# Altium schematic sheet HX711_load_cell_amplifier.SchDoc: HX711 load cell amplifier
size A4; SheetNumber: 19; SheetTotal: 20; TitleBig: HX711 load cell amplifier; Desc_line1: This circuit is used to get weight measurements out from load cells in order to estimate the density of a trunk or board.; Desc_line2: This design is based on the Sparkfun HX711 module by N. Seidle and A. Wende.
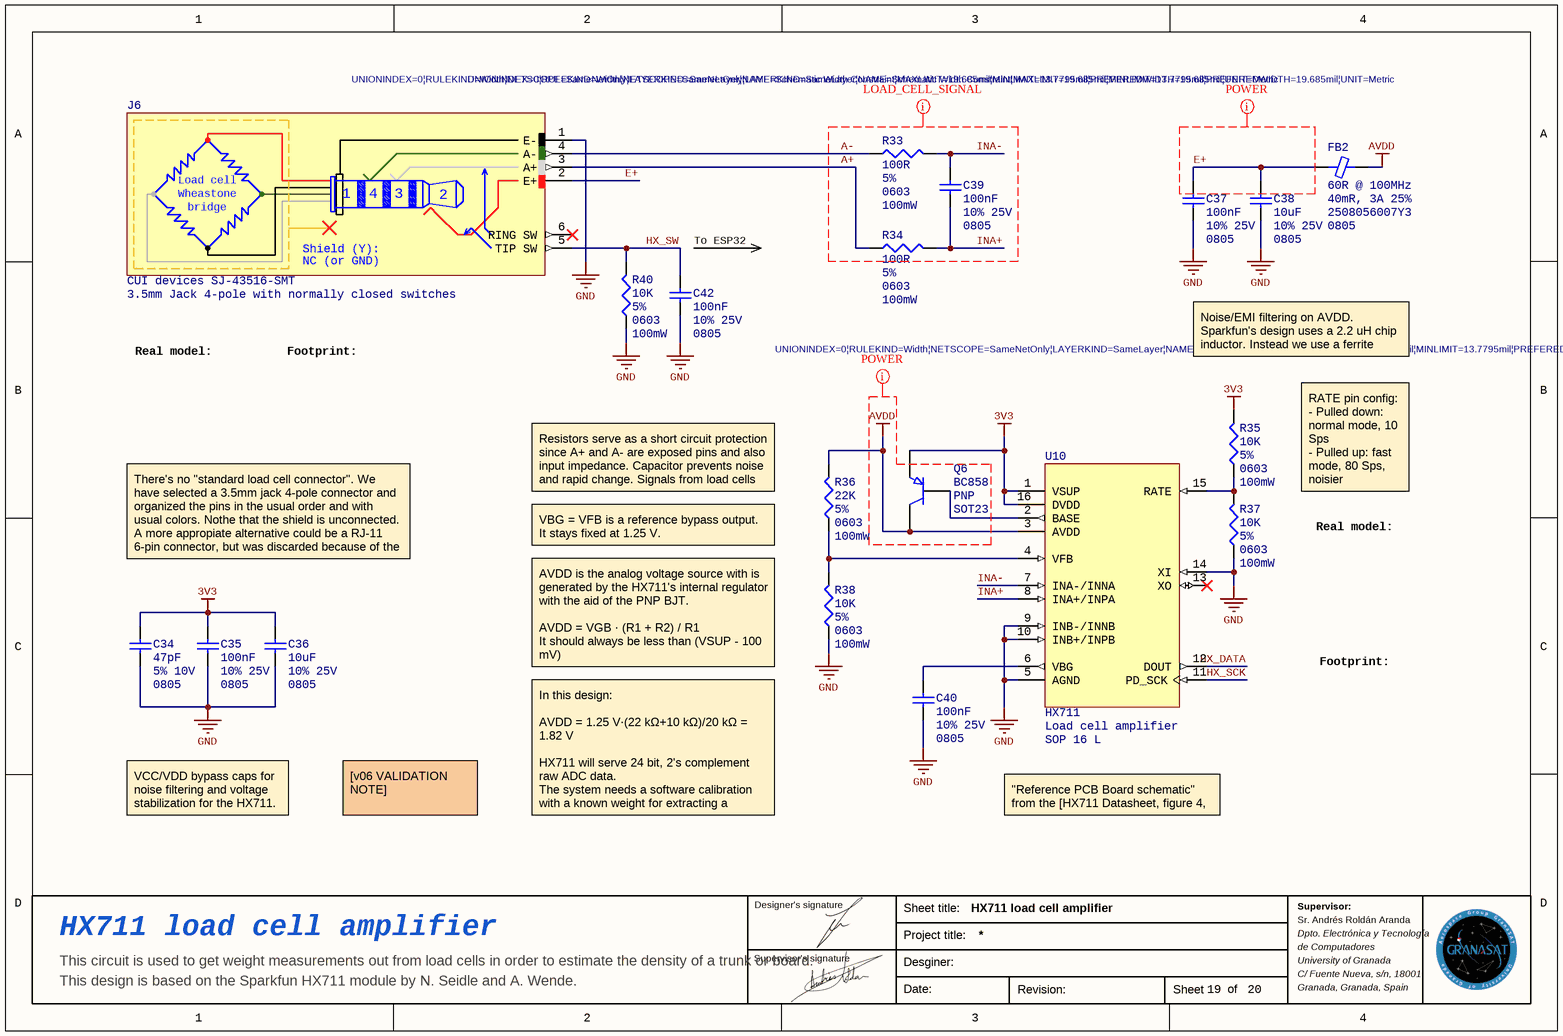
[diagram p0: HX711_load_cell_amplifier.SchDoc]

## Parts
C34  value 47pF  Tolerance: 5% 10V  PackageDescription: 0805  [CAP 0805_2012]  (hidden comment: Cap_cer_0805)
C35  value 100nF  Tolerance: 10% 25V  PackageDescription: 0805  [CAP 0805_2012]  (hidden comment: Cap_cer_0805)
C36  value 10uF  Tolerance: 10% 25V  PackageDescription: 0805  [CAP 0805_2012]  (hidden comment: Cap_cer_0805)
C37  value 100nF  Tolerance: 10% 25V  PackageDescription: 0805  [CAP 0805_2012]  (hidden comment: Cap_cer_0805)
C38  value 10uF  Tolerance: 10% 25V  PackageDescription: 0805  [CAP 0805_2012]  (hidden comment: Cap_cer_0805)
C39  value 100nF  Tolerance: 10% 25V  PackageDescription: 0805  [CAP 0805_2012]  (hidden comment: Cap_cer_0805)
C40  value 100nF  Tolerance: 10% 25V  PackageDescription: 0805  [CAP 0805_2012]  (hidden comment: Cap_cer_0805)
C42  value 100nF  Tolerance: 10% 25V  PackageDescription: 0805  [CAP 0805_2012]  (hidden comment: Cap_cer_0805)
FB2  value 40mR, 3A 25%  Desc: 60R @ 100MHz  Part: 2508056007Y3  PackageDescription: 0805  [FER 0805_2012]  (hidden comment: Ferrite Bead Chip Fair-Rite 2508056007Y3)
J6  Part: CUI devices SJ-43516-SMT  [JACK_6_CONN_CUI_DEVICES_SJ-43516-SMT]  (hidden comment: CON LOAD CELL PORT JACK)
Q6  Part: BC858  Type: PNP  PackageDescription: SOT23  [SOT-23-3 TO-236AB BC858]  (hidden comment: PNP BJT BC858 transistor)
R33  value 100R  Tolerance: 5%  PackageDescription: 0603  PowerDisipated: 100mW  [RES 0603_1608]  (hidden comment: Res_0603_100R_5%_100mW)
R34  value 100R  Tolerance: 5%  PackageDescription: 0603  PowerDisipated: 100mW  [RES 0603_1608]  (hidden comment: Res_0603_100R_5%_100mW)
R35  value 10K  Tolerance: 5%  PackageDescription: 0603  PowerDisipated: 100mW  [RES 0603_1608]  (hidden comment: Res_0603_10K_5%_100mW_1)
R36  value 22K  Tolerance: 5%  PackageDescription: 0603  PowerDisipated: 100mW  [RES 0603_1608]  (hidden comment: Res_0603_22K_5%_100mW)
R37  value 10K  Tolerance: 5%  PackageDescription: 0603  PowerDisipated: 100mW  [RES 0603_1608]  (hidden comment: Res_0603_10K_5%_100mW_1)
R38  value 10K  Tolerance: 5%  PackageDescription: 0603  PowerDisipated: 100mW  [RES 0603_1608]  (hidden comment: Res_0603_10K_5%_100mW_1)
R40  value 10K  Tolerance: 5%  PackageDescription: 0603  PowerDisipated: 100mW  [RES 0603_1608]  (hidden comment: Res_0603_10K_5%_100mW_1)
U10  Part: HX711  Desc: Load cell amplifier  PackageDescription: SOP 16 L  [SOP-16 L HX711]  (hidden comment: IC HX711 load cell amp)

## Nets
3V3: C34.2 C35.2 C36.2 Q6.2(E) R35.2 U10.1(VSUP) U10.16(DVDD)
AVDD: FB2.2 Q6.3(C) R36.2 U10.3(AVDD)
GND: C34.1 C35.1 C36.1 C37.1 C38.1 C40.1 C42.1 J6.1(E-) R37.1 R38.1 R40.1 U10.5(AGND) U10.9(INB-/INNB) U10.10(INB+/INPB) U10.14(XI)
A+: J6.3(A+) R34.1
A-: J6.4(A-) R33.1
E+: C37.2 C38.2 FB2.1 J6.2(E+)
HX_DATA: U10.12(DOUT)
HX_SCK: U10.11(PD_SCK)
HX_SW: C42.2 J6.5(TIP_SW) R40.2
INA+: C39.1 R34.2 U10.8(INA+/INPA)
INA-: C39.2 R33.2 U10.7(INA-/INNA)
NetC40_2: C40.2 U10.6(VBG)
NetQ6_1: Q6.1(B) U10.2(BASE)
NetR35_1: R35.1 R37.2 U10.15(RATE)
NetR36_1: R36.1 R38.2 U10.4(VFB)

Not connected (* = marked no-connect by the designer): J6 6(RING_SW)*; U10 13(XO)*

## Layout directives
net class POWER; rule Width Constraint [Pref Width = 0.5mm    Min Width = 0.35mm    Max Width = 0.5mm]: AVDD, E+
net class LOAD_CELL_SIGNAL; rule Width Constraint [Pref Width = 0.5mm    Min Width = 0.35mm    Max Width = 0.5mm]: A+, A-, INA+, INA-

## Notes on the sheet
- (near C42) To ESP32
- Real model:
- Footprint:
- Noise/EMI filtering on AVDD. Sparkfun's design uses a 2.2 uH chip inductor. Instead we use a ferrite bead.
- Resistors serve as a short circuit protection since A+ and A- are exposed pins and also input impedance. Capacitor prevents noise and rapid change. Signals from load cells are slow.
- RATE pin config:
  - Pulled down: normal mode, 10 Sps
  - Pulled up: fast mode, 80 Sps, noisier
- There's no "standard load cell connector". We have selected a 3.5mm jack 4-pole connector and organized the pins in the usual order and with usual colors. Nothe that the shield is unconnected. A more appropiate alternative could be a RJ-11 6-pin connector, but was discarded because of the large socket size.
- VBG = VFB is a reference bypass output. It stays fixed at 1.25 V.
- AVDD is the analog voltage source with is generated by the HX711's internal regulator with the aid of the PNP BJT.
  AVDD = VGB · (R1 + R2) / R1
  It should always be less than (VSUP - 100 mV)
  [HX711 datasheet, page 4]
- VCC/VDD bypass caps for noise filtering and voltage stabilization for the HX711.
- [v06 VALIDATION NOTE]
  UNTESTED
- In this design:
  AVDD = 1.25 V·(22 kΩ+10 kΩ)/20 kΩ = 1.82 V
  HX711 will serve 24 bit, 2's complement raw ADC data.
  The system needs a software calibration with a known weight for extracting a correction factor for this design.
- "Reference PCB Board schematic" from the [HX711 Datasheet, figure 4, page 6]
- Designer's signature
- Sheet title:
- Sr. Andrés Roldán Aranda
- Supervisor:
- Supervisor's signature
- Project title:
- Desginer:
- Dpto. Electrónica y Tecnología
- de Computadores
- University of Granada
- C/ Fuente Nueva, s/n, 18001
- Granada, Granada, Spain
- Date:
- Revision:
- Sheet
- of
- (in symbol CON LOAD CELL PORT JACK) Load cell; Wheastone; bridge; Shield (Y):; NC (or GND)

## Library data of the parts
C34 = Cap_cer_0805_47pF_5%: Ceramic cap size 0805
C35 C37 C39 C40 C42 = Cap_cer_0805_100nF_10%: Ceramic cap size 0805
C36 C38 = Cap_cer_0805_10uF_10%: Ceramic cap size 0805
FB2 = Ferrite Bead Chip Fair-Rite 2508056007Y3: 0805, 60Ω, 3A, 25% SMT
J6 = CON LOAD CELL PORT JACK: 3.5mm Jack 4-pole with normally closed switches; PackageDescription: 3.5mm Jack 4-pole with normally closed switches
Q6 = PNP BJT BC858 transistor: 65 V, 100 mA PNP general-purpose transistor
R33 R34 = Res_0603_100R_5%_100mW: Res size 0603 SMD mounting, low power
R35 R37 R38 R40 = Res_0603_10K_5%_100mW_1: Res size 0603 SMD mounting, low power
R36 = Res_0603_22K_5%_100mW: Res size 0603 SMD mounting, low power
U10 = IC HX711 load cell amp: HX711 load cell amplifier